# EAGLE design NanoLite (EAGLE 6.3)
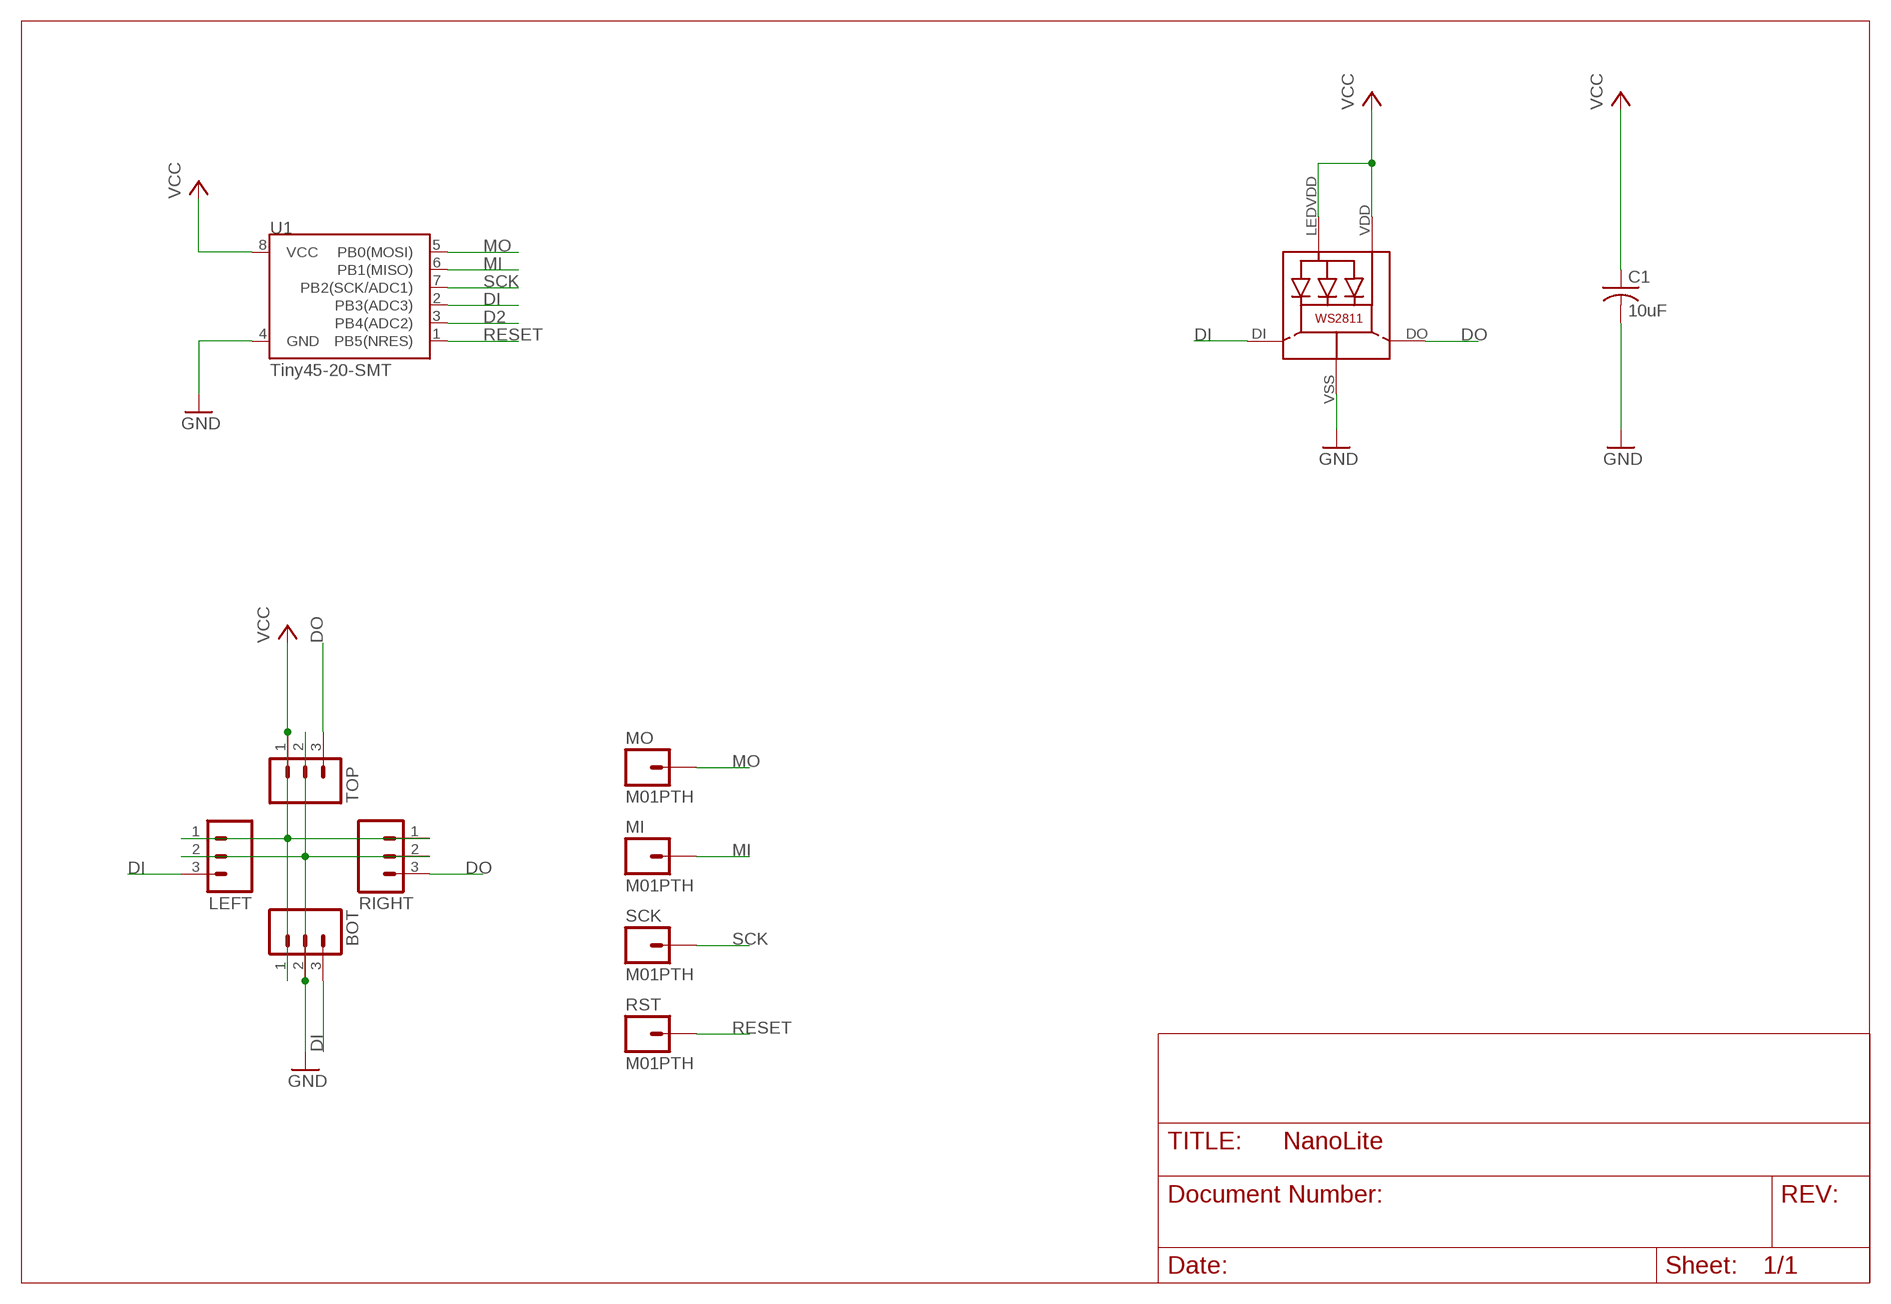
[diagram p0: schematic, sheet 1]

## Parts
BOT  M03PTH  [1X03]
C1  10uF  C-USC0805K  [C0805K]
LED1  WS28115050  [WS28115050]
LEFT  M03PTH  [1X03]
MI  M01PTH  [1X01]
MO  M01PTH  [1X01]
RIGHT  M03PTH  [1X03]
RST  M01PTH  [1X01]
SCK  M01PTH  [1X01]
TOP  M03PTH  [1X03]
U1  Tiny45-20-SMT  ATTINY45TINY45-20-SMT  [SO08-EIAJ]

## Nets
D2: U1.3(PB4(ADC2))
DI: BOT.3 LED1.DI LEFT.3 U1.2(PB3(ADC3))
DO: LED1.DO RIGHT.3 TOP.3
GND: BOT.2 C1.2 LED1.VSS(GND) LEFT.2 RIGHT.2 TOP.2 U1.4(GND)
MI: MI.1 U1.6(PB1(MISO))
MO: MO.1 U1.5(PB0(MOSI))
N$1: LED1.LEDVDD LED1.VDD ; supply symbol labelled VCC
RESET: RST.1 U1.1(PB5(NRES))
SCK: SCK.1 U1.7(PB2(SCK/ADC1))
VCC: BOT.1 C1.1 LEFT.1 RIGHT.1 TOP.1 U1.8(VCC)

## Library data of the parts
BOT LEFT RIGHT TOP = SparkFun-Connectors:M03: Header 3 Standard 3-pin 0.1" header. Use with straight break away headers (SKU : PRT-00116), right angle break away headers (PRT-00553), swiss pins (PRT-00743), machine pins (PRT-00117), and female headers (PRT-00115). Molex polarized connector foot print use with SKU : PRT-08232 with associated crimp pins and housings.
C1 = adafruit:C-US: CAPACITOR, American symbol
LED1 = microbuilder:WS28115050
MI MO RST SCK = SparkFun-Connectors:M01: Header 1 Standard 1-pin 0.1" header. Use with straight break away headers (SKU : PRT-00116), right angle break away headers (PRT-00553), swiss pins (PRT-00743), machine pins (PRT-00117), and female headers (PRT-00115).
U1 = SparkFun-DigitalIC:ATTINY45: Atmel 8-pin 2/4/8kB flash uC; PROD_ID: IC-08922

## Board
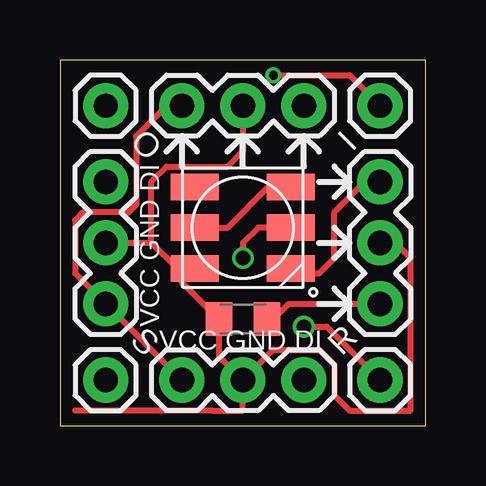
[diagram p1: board, top side]
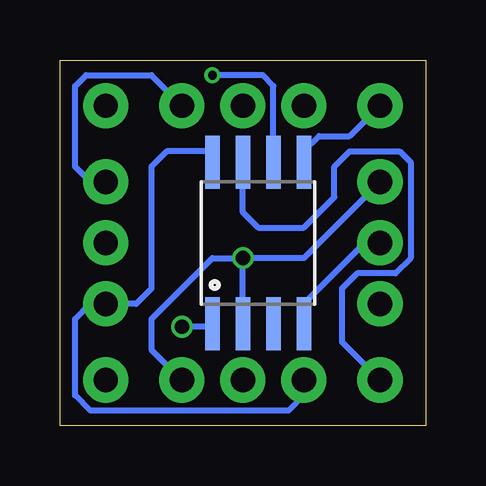
[diagram p2: board, bottom side, seen from below]

Size 15.24 x 15.24 mm. Coordinates in mm from the lower left corner, seen from the top.
Outline: 0,0 15.24,0 15.24,15.24 0,15.24 0,0
Copper layers (1*16): Top 0.035mm / dielectric 1.5mm / Bottom 0.035mm
Design rules "Fusion_eagle_rule_v1.1": minimum track width 6mil, minimum drill 12mil, track to track 6mil, track to pad 6mil, pad to pad 6mil, via to via 6mil, smd to smd 0mil, copper to edge 10mil, drill to drill 10mil, minimum pad ring 10mil, minimum via ring 6mil, stop-mask expansion 2mil, vias tented up to drill 100mil, thermal gap 10mil

### Footprints (pad centres in the part's own frame; a part is rotated, then mirrored left to right if it is on the bottom)
1X03 = drill 1.016 pad 1.88: 1 0,0; 2 2.54,0; 3 5.08,0
C0805K = smd 1.1 x 1.4: 1 -1,0; 2 1,0
WS28115050 = smd 2 x 1.1: DI 2,0; DO 2,-1.7; LEDVDD -2,0; NC -2,1.7; VDD 2,1.7; VSS -2,-1.7
1X01 = drill 1.016 pad 1.88: 1 0,0
SO08-EIAJ = smd 0.61 x 2.21: 1 -1.905,-3.378; 2 -0.635,-3.378; 3 0.635,-3.378; 4 1.905,-3.378; 5 1.905,3.353; 6 0.635,3.353; 7 -0.635,3.353; 8 -1.905,3.353

### Placement (x,y rotation side)
BOT  5.08,1.91 0 top
C1  7.62,4.45 180 top
LED1  7.62,8.26 0 top
LEFT  1.91,5.08 90 top
MI  13.34,13.34 0 top
MO  1.91,13.34 0 top
RIGHT  13.34,5.08 90 top
RST  13.34,1.91 0 top
SCK  1.91,1.91 0 top
TOP  5.08,13.34 0 top
U1  6.99,7.62 0 bottom

### Tracks (layer width: path | path; a pad name or v marks a point on that pad's centre or on a via)
DI  (via drill 0.6)
  Top 0.254: LED1.DI 8.26,8.26 7.62,7.62 v7.62,6.99
  Bottom 0.254: LEFT.3 5.08,6.99 v7.62,6.99 | U1.2 v7.62,6.99 | BOT.3 11.43,3.17 11.43,4.45 8.89,6.99 v7.62,6.99
DO
  Top 0.254: RIGHT.3 12.7,10.16 11.43,8.89 11.43,6.99 10.79,6.35 9.82,6.35 LED1.DO
  Bottom 0.254: TOP.3 11.43,14.61 14.16,14.61 14.61,14.16 14.61,10.79 13.97,10.16 RIGHT.3
GND
  Top 0.25: 6.35,0.64 7.62,0.64 BOT.2
  Top 0.254: 5.08,5.99 C1.2 6.62,2.9 BOT.2 8.89,3.17 10.79,3.17 11.43,2.54 11.43,1.27 12.06,0.64 14.61,0.64 14.61,6.99 13.97,7.62 RIGHT.2 | 5.08,5.99 5.08,5.92 | TOP.2 7.62,11.43 6.99,10.79 4.45,10.79 3.81,10.16 3.81,7.62 | LED1.VSS 5.08,6.55 | 5.08,6.55 4.88,6.55 3.81,7.62 | LEFT.2 3.81,7.62 | 5.08,5.99 5.08,6.55 | 6.35,0.64 0.64,0.64
  Bottom 0.254: U1.4 5.08,5.08 2.54,7.62 LEFT.2
MI  (via drill 0.36)
  Top 0.254: MI.1 12.06,14.61 v8.89,14.61
  Bottom 0.254: U1.6 6.35,14.16 6.8,14.61 v8.89,14.61
MO
  Bottom 0.254: MO.1 3.17,12.06 4.45,12.06 5.08,11.43 U1.5
N$1
  Top 0.254: LED1.LEDVDD 6.99,8.26 8.69,9.96 LED1.VDD
RESET  (via drill 0.6)
  Top 0.254: v10.16,4.13 11.11,4.13 RST.1
  Bottom 0.254: U1.1 9,4.13 v10.16,4.13
SCK
  Bottom 0.254: U1.7 7.62,8.89 6.99,8.26 5.08,8.26 3.81,9.53 3.81,10.79 3.17,11.43 1.08,11.43 0.64,10.98 0.64,6.99 1.27,6.35 2.86,6.35 3.49,5.71 3.49,3.49 SCK.1
VCC
  Top 0.254: C1.1 8.89,4.45 9.53,5.08 RIGHT.1 | TOP.1 4.45,13.34 3.17,12.06 3.17,9.21 2.86,8.89 0.95,8.89 0.64,8.57 0.64,6.35 LEFT.1 BOT.1
  Bottom 0.254: U1.8 9.07,11.43 10.79,11.43 11.43,10.79 11.43,5.71 12.06,5.08 RIGHT.1 13.97,5.08 14.61,4.45 14.61,1.27 13.97,0.64 5.71,0.64 5.08,1.27 BOT.1

### Text on the board
tNames: O | I | VCC GND DI | S | VCC GND DI | R